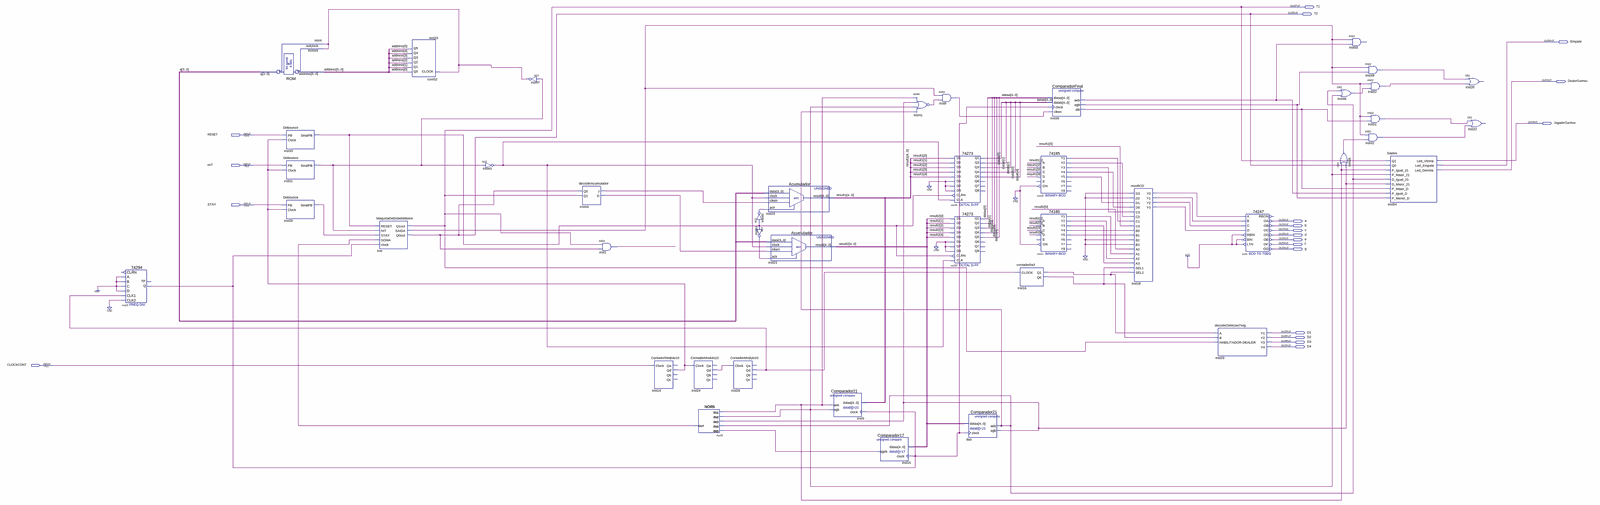
[diagram p0: schematic sheet, whole]
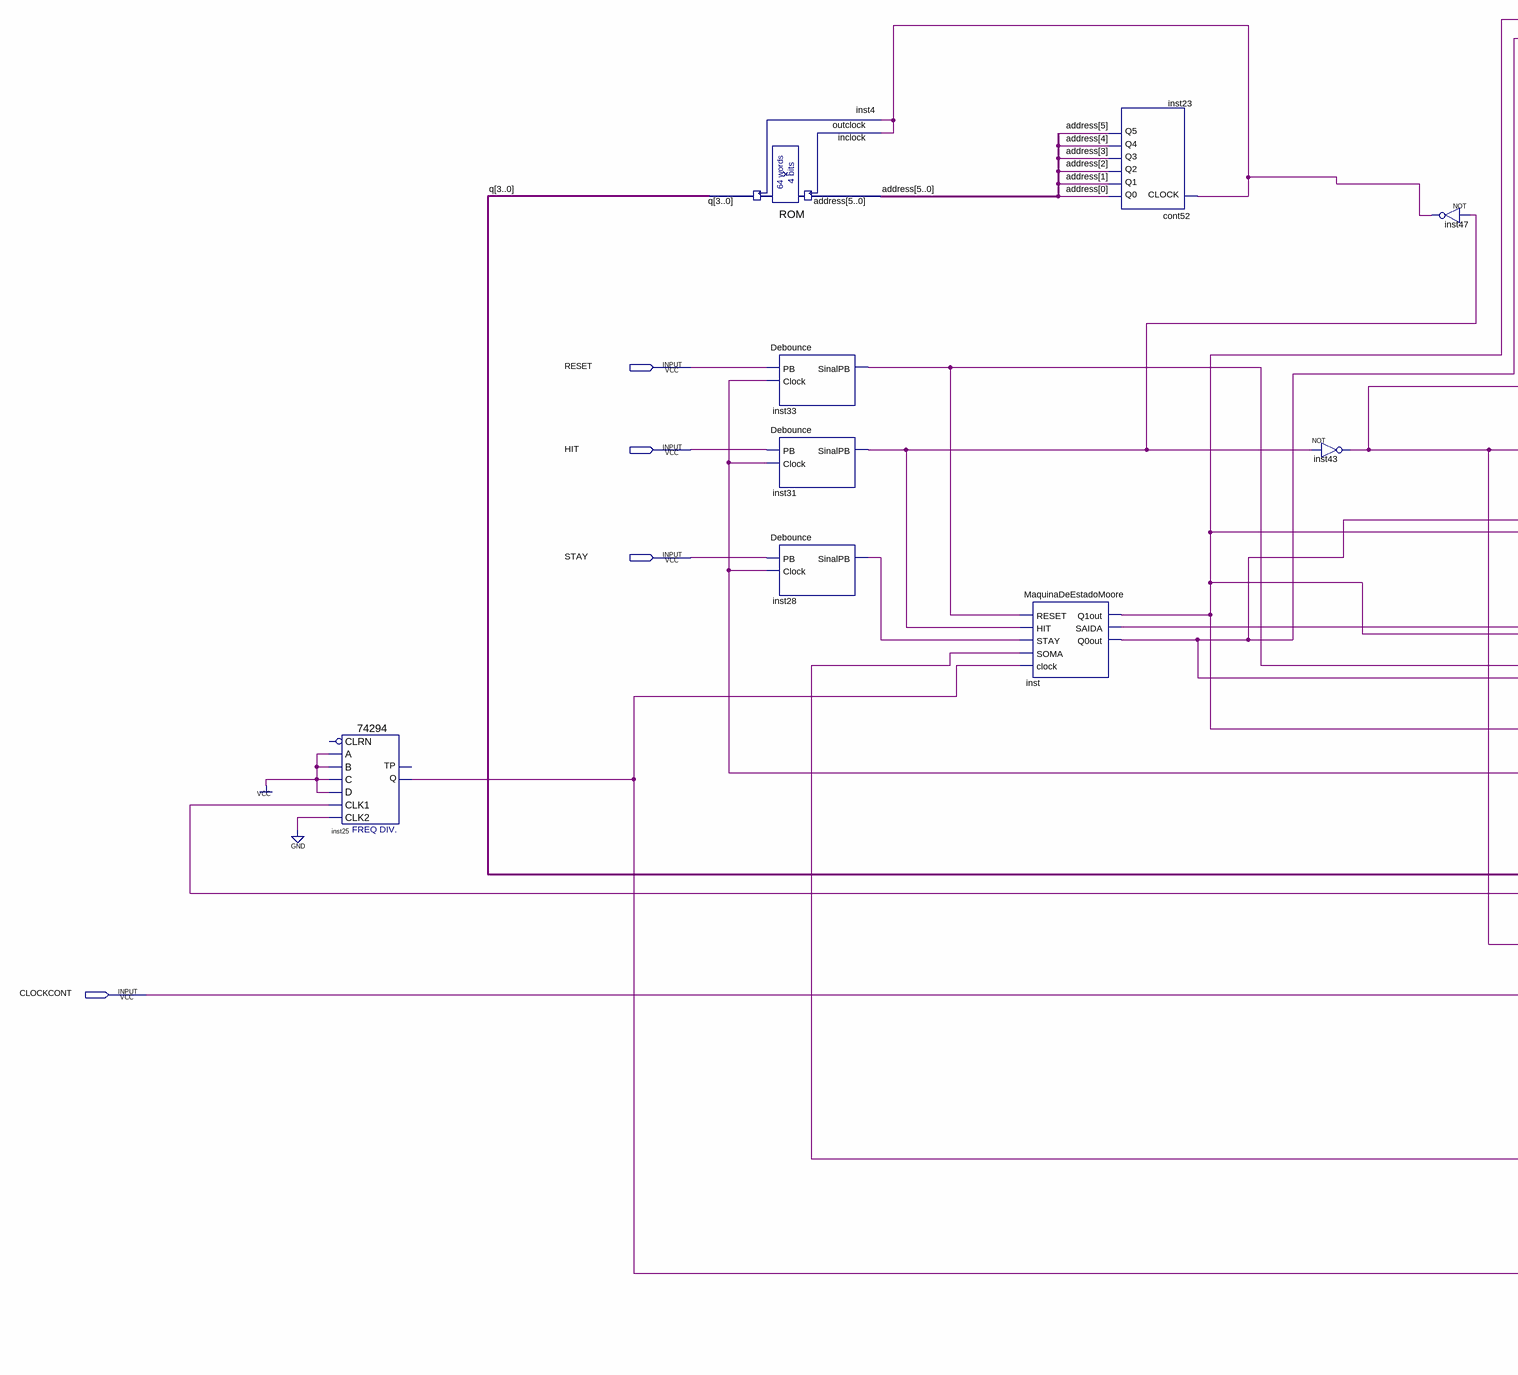
[diagram p1: schematic sheet, left part]
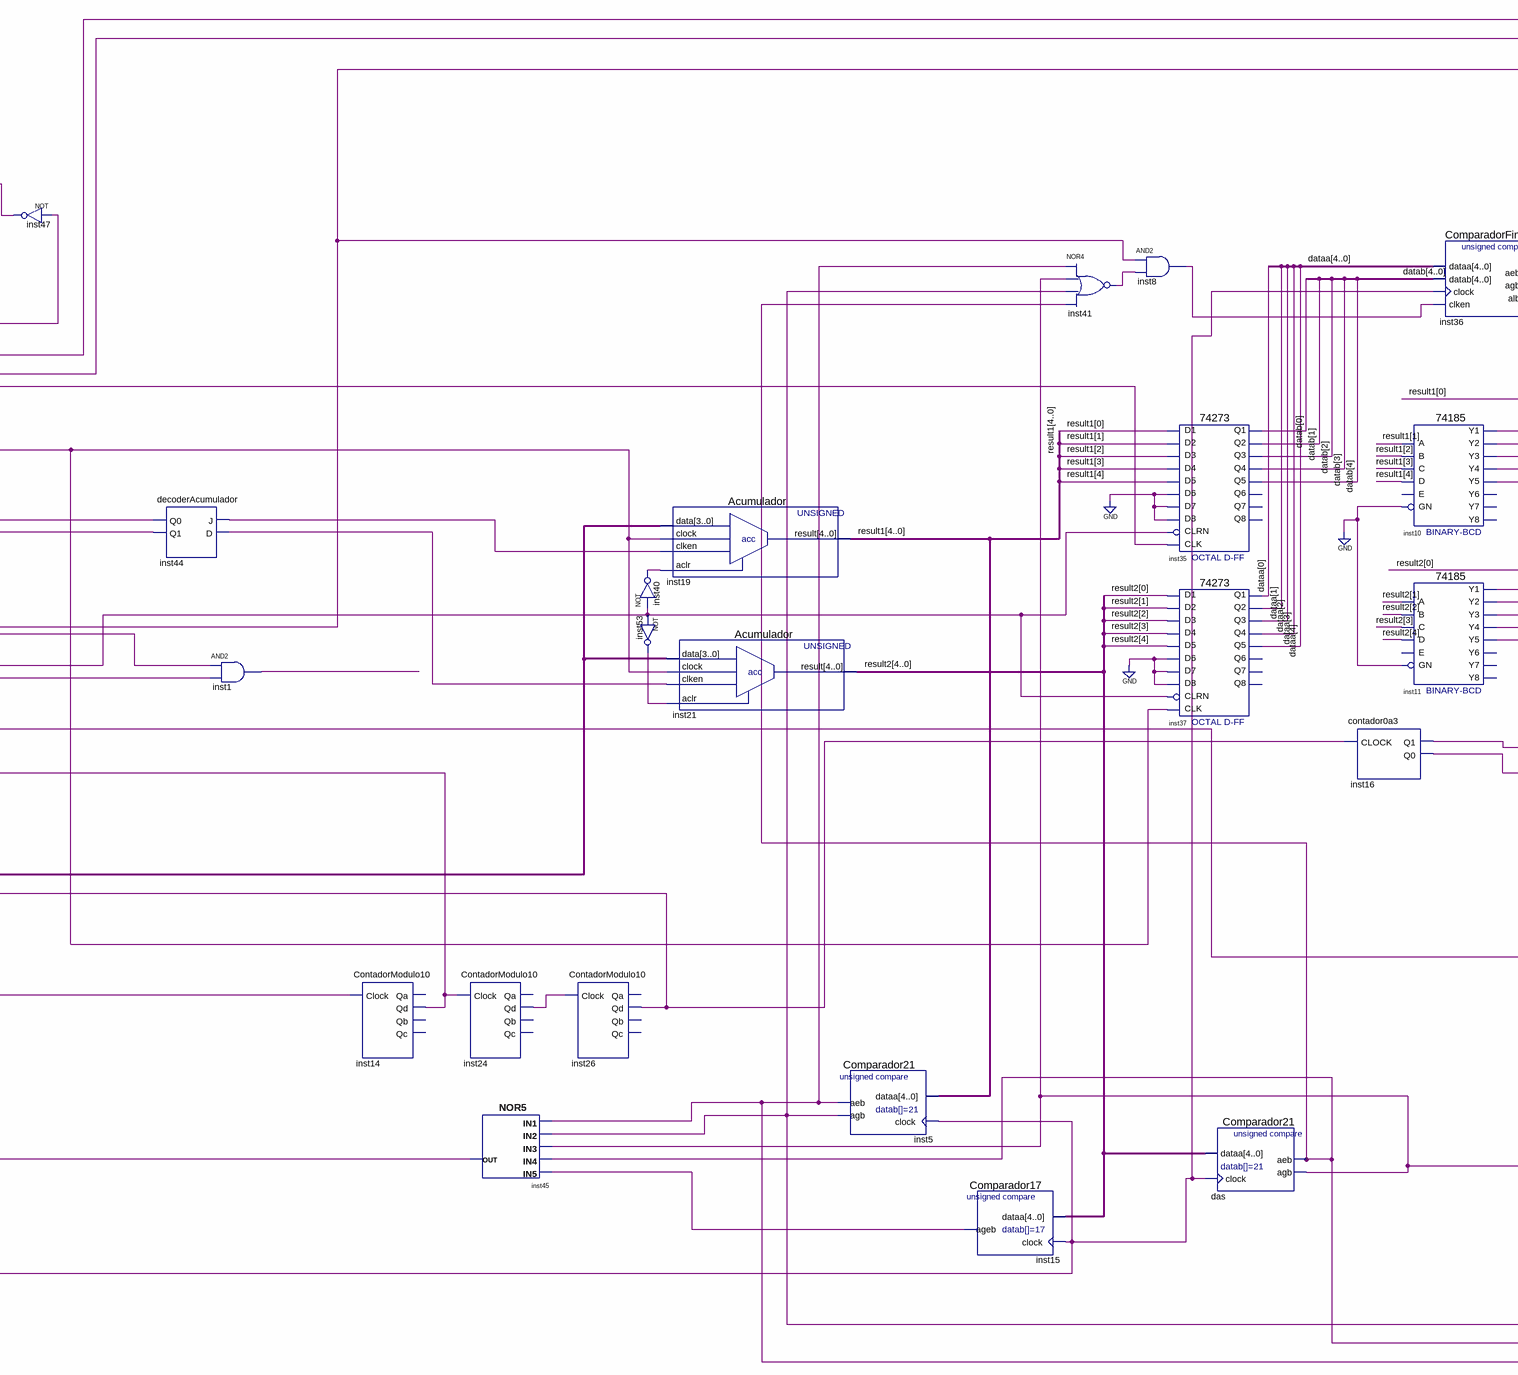
[diagram p2: schematic sheet, centre part]
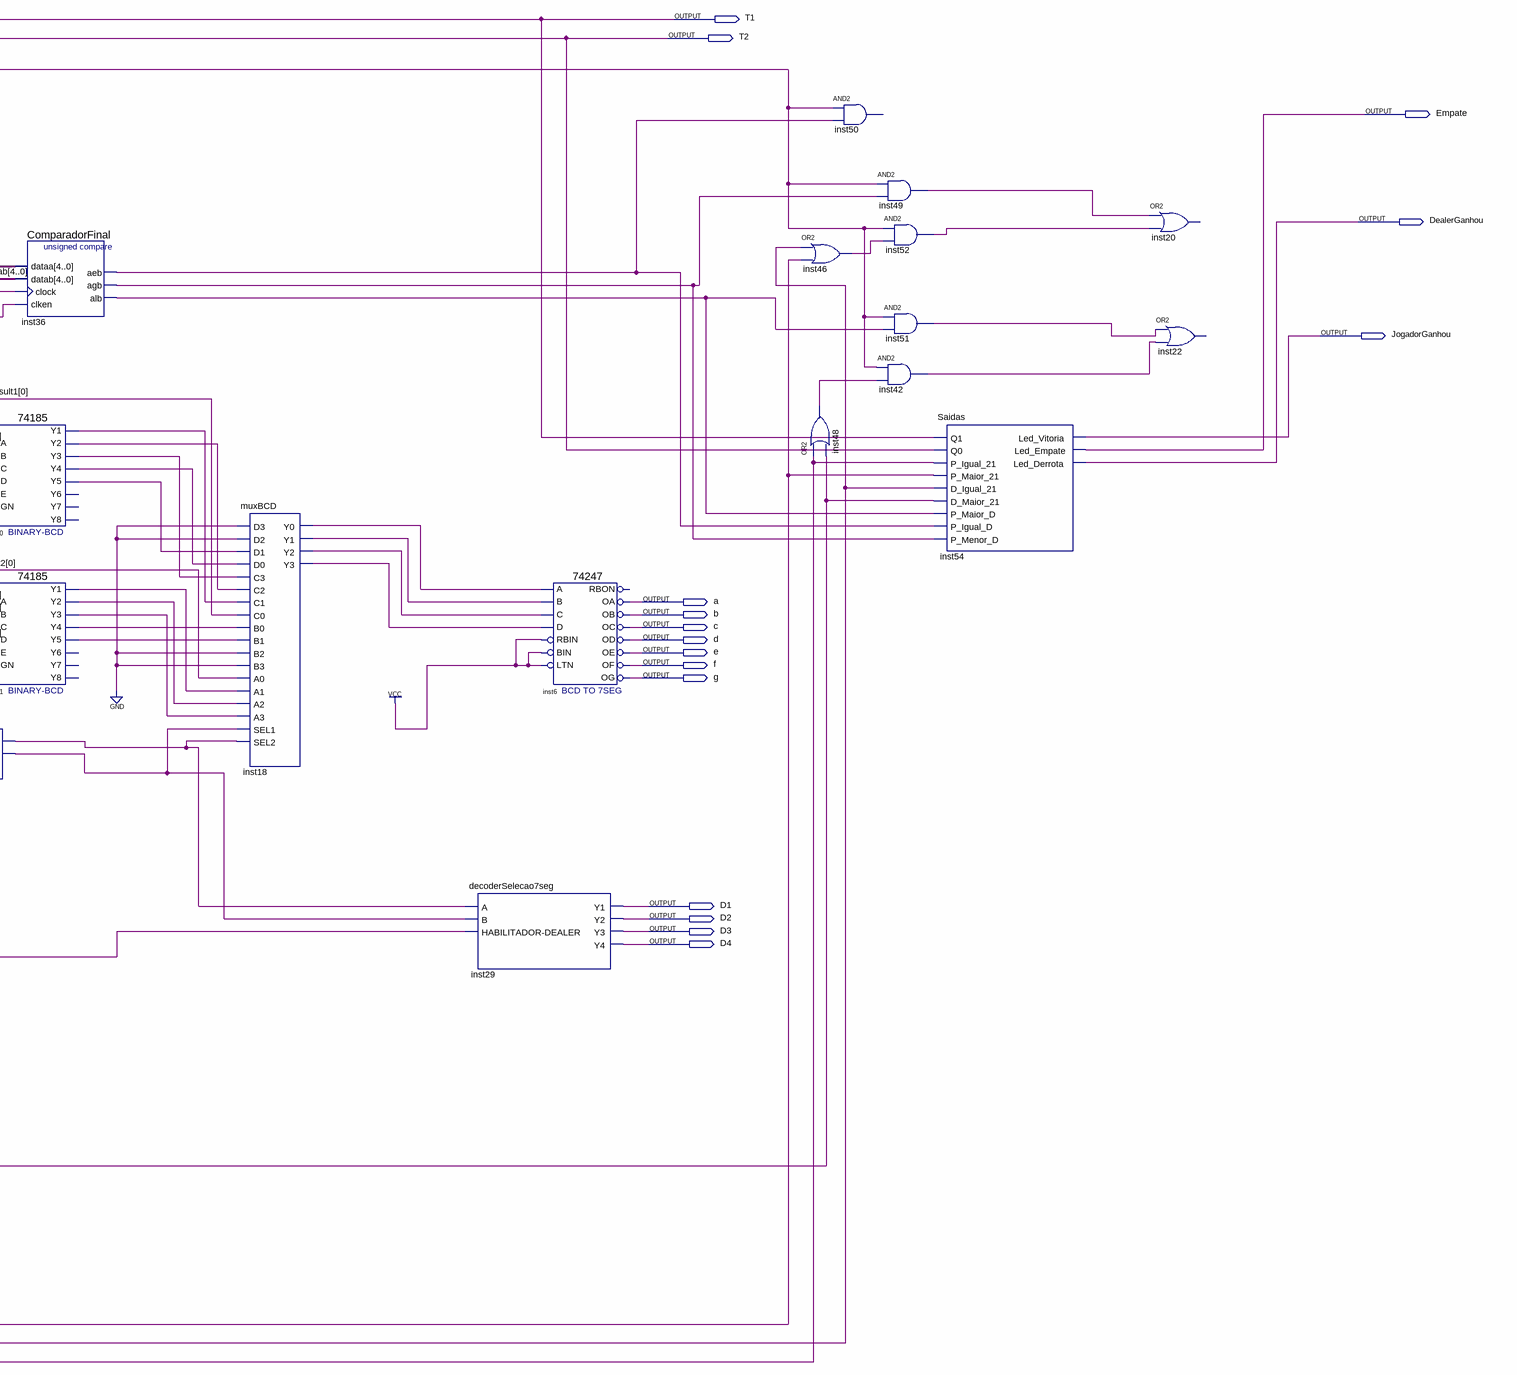
[diagram p3: schematic sheet, right part]
// Quartus schematic 21Game.bdf as structural Verilog: 43 symbols, 20 pins
module \21Game  (
  input  RESET,
  input  HIT,
  input  STAY,
  input  CLOCKCONT,
  output T1,
  output T2,
  output Empate,
  output DealerGanhou,
  output JogadorGanhou,
  output a,
  output b,
  output c,
  output d,
  output e,
  output f,
  output g,
  output D1,
  output D2,
  output D3,
  output D4
);

  wire das_aeb, das_agb, inst1_out, inst5_aeb, inst5_agb, inst8_out, inst10_y1, inst10_y2, inst10_y3,
       inst10_y4, inst10_y5, inst11_y1, inst11_y2, inst11_y3, inst11_y4, inst11_y5, inst14_qd, inst15_ageb,
       inst16_q0, inst16_q1, inst18_y0, inst18_y1, inst18_y2, inst18_y3, inst24_qd, inst25_q, inst26_qd,
       inst28_sinalpb, inst31_sinalpb, inst33_sinalpb, inst36_aeb, inst36_agb, inst36_alb, inst40_out,
       inst41_out, inst42_out, inst43_out, inst44_d, inst44_j, inst45_out, inst46_out, inst47_out,
       inst48_out, inst49_out, inst51_out, inst52_out, inst53_out, inst_saida;
  wire [3:0] q;
  wire [4:0] dataa, datab, result1, result2;
  wire [5:0] address;

  \74294  inst25 (
    .A(1'b1), .B(1'b1), .C(1'b1), .CLK1(inst26_qd), .CLK2(1'b0), .D(1'b1), .Q(inst25_q));  // open: CLRN, TP
  ROM inst4 (.address(address), .inclock(inst47_out), .outclock(inst47_out), .q(q));
  Debounce inst33 (.PB(RESET), .Clock(inst14_qd), .SinalPB(inst33_sinalpb));
  Debounce inst31 (.PB(HIT), .Clock(inst14_qd), .SinalPB(inst31_sinalpb));
  Debounce inst28 (.PB(STAY), .Clock(inst14_qd), .SinalPB(inst28_sinalpb));
  MaquinaDeEstadoMoore inst (
    .RESET(inst33_sinalpb), .HIT(inst31_sinalpb), .STAY(inst28_sinalpb), .SOMA(inst45_out), .clock(inst25_q),
    .Q1out(T1), .SAIDA(inst_saida), .Q0out(T2));
  cont52 inst23 (
    .CLOCK(inst47_out), .Q0(address[0]), .Q1(address[1]), .Q2(address[2]), .Q3(address[3]), .Q4(address[4]),
    .Q5(address[5]));
  not inst43 (inst43_out, inst31_sinalpb);
  not inst47 (inst47_out, inst31_sinalpb);
  decoderAcumulador inst44 (.Q0(T2), .Q1(T1), .J(inst44_j), .D(inst44_d));
  and inst1 (inst1_out, T1, T2);
  ContadorModulo10 inst14 (.Clock(CLOCKCONT), .Qd(inst14_qd));  // open: Qa, Qb, Qc
  ContadorModulo10 inst24 (.Clock(inst14_qd), .Qd(inst24_qd));  // open: Qa, Qb, Qc
  nor inst45 (inst45_out, inst5_aeb, inst5_agb, das_agb, das_aeb, inst15_ageb);
  ContadorModulo10 inst26 (.Clock(inst24_qd), .Qd(inst26_qd));  // open: Qa, Qb, Qc
  not inst40 (inst40_out, inst33_sinalpb);
  not inst53 (inst53_out, inst33_sinalpb);
  Acumulador inst19 (.data(q), .clock(inst43_out), .clken(inst44_j), .aclr(inst40_out), .result(result1));
  Acumulador inst21 (.data(q), .clock(inst43_out), .clken(inst44_d), .aclr(inst53_out), .result(result2));
  Comparador21 inst5 (.dataa(result1), .clock(inst25_q), .aeb(inst5_aeb), .agb(inst5_agb));
  Comparador17 inst15 (.dataa(result2), .clock(inst25_q), .ageb(inst15_ageb));
  nor inst41 (inst41_out, inst5_aeb, das_agb, inst5_agb, das_aeb);
  and inst8 (inst8_out, inst_saida, inst41_out);
  \74273  inst35 (
    .D2(result1[1]), .D3(result1[2]), .D1(result1[0]), .D4(result1[3]), .D7(1'b0), .D6(1'b0),
    .D5(result1[4]), .D8(1'b0), .CLK(inst43_out), .CLRN(inst33_sinalpb), .Q4(datab[3]), .Q1(datab[0]),
    .Q2(datab[1]), .Q3(datab[2]), .Q5(datab[4]));  // open: Q6, Q7, Q8
  \74273  inst37 (
    .D2(result2[1]), .D3(result2[2]), .D1(result2[0]), .D4(result2[3]), .D7(1'b0), .D6(1'b0),
    .D5(result2[4]), .D8(1'b0), .CLK(inst43_out), .CLRN(inst33_sinalpb), .Q4(dataa[3]), .Q1(dataa[0]),
    .Q2(dataa[1]), .Q3(dataa[2]), .Q5(dataa[4]));  // open: Q6, Q7, Q8
  Comparador21 das (.dataa(result2), .clock(inst25_q), .aeb(das_aeb), .agb(das_agb));
  contador0a3 inst16 (.CLOCK(inst26_qd), .Q1(inst16_q1), .Q0(inst16_q0));
  \74185  inst10 (
    .A(result1[1]), .B(result1[2]), .D(result1[4]), .C(result1[3]), .GN(1'b0), .Y1(inst10_y1),
    .Y3(inst10_y3), .Y2(inst10_y2), .Y5(inst10_y5), .Y4(inst10_y4));  // open: E, Y6, Y8, Y7
  \74185  inst11 (
    .A(result2[1]), .B(result2[2]), .D(result2[4]), .C(result2[3]), .GN(1'b0), .Y1(inst11_y1),
    .Y3(inst11_y3), .Y2(inst11_y2), .Y5(inst11_y5), .Y4(inst11_y4));  // open: E, Y6, Y8, Y7
  ComparadorFinal inst36 (
    .dataa(dataa), .datab(datab), .clock(inst25_q), .clken(inst8_out), .aeb(inst36_aeb), .agb(inst36_agb),
    .alb(inst36_alb));
  muxBCD inst18 (
    .D3(1'b0), .D2(1'b0), .D1(inst10_y5), .D0(inst10_y4), .C3(inst10_y3), .C2(inst10_y2), .C1(inst10_y1),
    .C0(result1[0]), .B0(inst11_y4), .B1(inst11_y5), .B2(1'b0), .B3(1'b0), .A0(result2[0]), .A1(inst11_y1),
    .A2(inst11_y2), .A3(inst11_y3), .SEL1(inst16_q0), .SEL2(inst16_q1), .Y0(inst18_y0), .Y1(inst18_y1),
    .Y2(inst18_y2), .Y3(inst18_y3));
  decoderSelecao7seg inst29 (
    .A(inst16_q1), .B(inst16_q0), .\HABILITADOR-DEALER (T1), .Y1(D1), .Y2(D2), .Y3(D3), .Y4(D4));
  \74247  inst6 (
    .LTN(1'b1), .BIN(1'b1), .A(inst18_y0), .B(inst18_y1), .RBIN(1'b1), .C(inst18_y2), .D(inst18_y3), .OF(f),
    .OC(c), .OD(d), .OE(e), .OA(a), .OB(b), .OG(g));  // open: RBON
  or inst46 (inst46_out, das_aeb, inst5_agb);
  or inst48 (inst48_out, inst5_aeb, das_agb);
  // AND2 inst50 has open pins: IN1=inst_saida, IN2=inst36_aeb, OUT=open
  and inst49 (inst49_out, inst_saida, inst36_agb);
  and inst52 (inst52_out, inst_saida, inst46_out);
  and inst51 (inst51_out, inst_saida, inst36_alb);
  and inst42 (inst42_out, inst_saida, inst48_out);
  Saidas inst54 (
    .Q1(T1), .Q0(T2), .P_Igual_21(inst5_aeb), .P_Maior_21(inst5_agb), .D_Igual_21(das_aeb),
    .D_Maior_21(das_agb), .P_Maior_D(inst36_alb), .P_Igual_D(inst36_aeb), .P_Menor_D(inst36_agb),
    .Led_Vitoria(JogadorGanhou), .Led_Empate(Empate), .Led_Derrota(DealerGanhou));
  // OR2 inst20 has open pins: IN1=inst49_out, IN2=inst52_out, OUT=open
  // OR2 inst22 has open pins: IN1=inst51_out, IN2=inst42_out, OUT=open
endmodule
